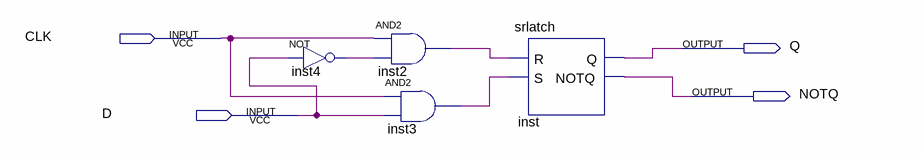
[diagram p0: schematic sheet]
// Quartus schematic latchd.bdf as structural Verilog: 4 symbols, 4 pins
module latchd (
  input  CLK,
  input  D,
  output Q,
  output NOTQ
);

  wire inst2_out, inst3_out, inst4_out;

  not inst4 (inst4_out, D);
  and inst2 (inst2_out, CLK, inst4_out);
  and inst3 (inst3_out, CLK, D);
  srlatch inst (.R(inst2_out), .S(inst3_out), .Q(Q), .NOTQ(NOTQ));
endmodule
